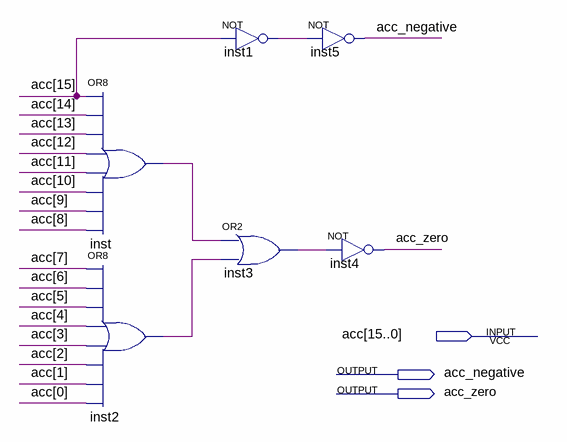
[diagram p0: schematic sheet]
// Quartus schematic controler_acc_watcher.bdf as structural Verilog: 6 symbols, 3 pins
module controler_acc_watcher (
  input  [15:0] acc,
  output acc_negative,
  output acc_zero
);

  wire inst1_out, inst2_out, inst3_out, inst_out;

  or inst (inst_out, acc[15], acc[14], acc[13], acc[12], acc[11], acc[10], acc[9], acc[8]);
  or inst2 (inst2_out, acc[7], acc[6], acc[5], acc[4], acc[3], acc[2], acc[1], acc[0]);
  not inst1 (inst1_out, acc[15]);
  or inst3 (inst3_out, inst_out, inst2_out);
  not inst5 (acc_negative, inst1_out);
  not inst4 (acc_zero, inst3_out);
endmodule
